# Altium schematic sheet slave-connector.SchDoc
size A3; DocumentNumber: 5; SheetNumber: 5; SheetTotal: 6; SheetDescription: Slave Connector
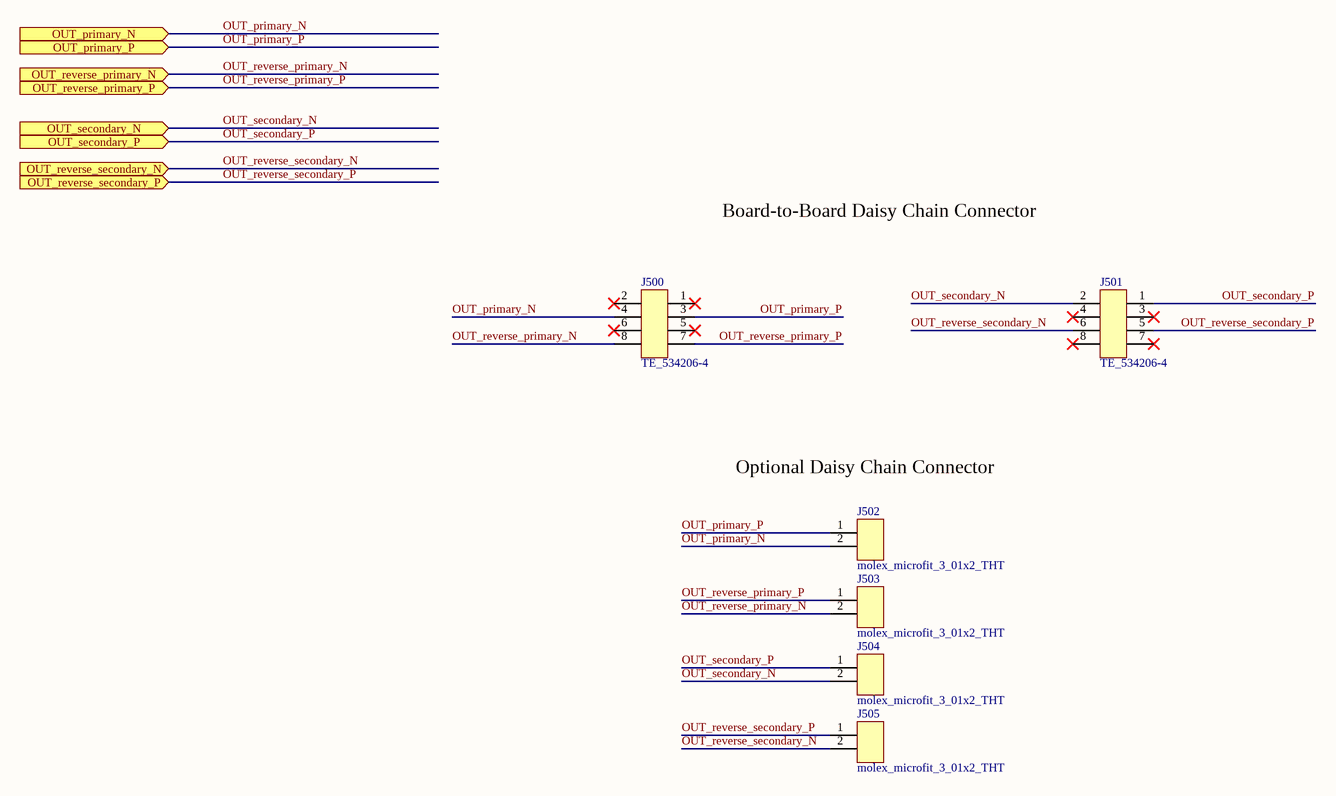
[diagram p0: slave-connector.SchDoc]

## Parts
J500  TE_534206-4  [TE_534206-4]
J501  TE_534206-4  [TE_534206-4]
J502  molex_microfit_3_01x2_THT  [MOLEX_MICROFIT_01x2_THT]
J503  molex_microfit_3_01x2_THT  [MOLEX_MICROFIT_01x2_THT]
J504  molex_microfit_3_01x2_THT  [MOLEX_MICROFIT_01x2_THT]
J505  molex_microfit_3_01x2_THT  [MOLEX_MICROFIT_01x2_THT]

## Ports
OUT_primary_N (in), OUT_primary_P (in), OUT_reverse_primary_N (in), OUT_reverse_primary_P (in), OUT_reverse_secondary_N (in), OUT_reverse_secondary_P (in), OUT_secondary_N (in), OUT_secondary_P (in)

## Nets
OUT_primary_N: J500.4 J502.2 ; port OUT_primary_N
OUT_primary_P: J500.3 J502.1 ; port OUT_primary_P
OUT_reverse_primary_N: J500.8 J503.2 ; port OUT_reverse_primary_N
OUT_reverse_primary_P: J500.7 J503.1 ; port OUT_reverse_primary_P
OUT_reverse_secondary_N: J501.6 J505.2 ; port OUT_reverse_secondary_N
OUT_reverse_secondary_P: J501.5 J505.1 ; port OUT_reverse_secondary_P
OUT_secondary_N: J501.2 J504.2 ; port OUT_secondary_N
OUT_secondary_P: J501.1 J504.1 ; port OUT_secondary_P

Not connected (* = marked no-connect by the designer): J500 1* 2* 5* 6*; J501 3* 4* 7* 8*

## Notes on the sheet
- Board-to-Board Daisy Chain Connector
- Optional Daisy Chain Connector
- Fraunhofer IISB
- Schottkystr. 10
- developed by:
- 91058 Erlangen
- Germany
- Author
- Project
- License
- Description
- File
- Version
- Release Date
- Sheet
- www.foxbms.org
- www.iisb.fraunhofer.de
- foxBMS Team
- /

## Library data of the parts
J500 J501 = TE_534206-4: Board-To-Board Connector, Dual, 2.54 mm, 8 Contacts, Receptacle, Through Hole, 2 Rows; Manufacturer: TE; Circuits: 8; Rated Voltage: 333V AC; Rated Current: 2A; Automotive Qualified: False; Part Number: TE_534206-4; Part Name: 534206-4; Operating Temperature: −65 °C - +105 °C; ComponentLink1Description: Datasheet; ComponentLink1URL: https://www.te.com/deu-de/product-534206-4.html#pdp-docs-features; Supplier 1: Digikey; Supplier Part Number 1: A26454-ND
J502-J505 = molex_microfit_3_01x2_THT: Micro-Fit 3.0 Right Angle Header, 3.00mm Pitch, Dual Row, 2 Circuits, with Snap-in Plastic Peg PCB Lock, Tin, Glow Wire Capable, Black, 43045-0200; Manufacturer: Molex; Circuits: 2; Rated Voltage: 600V; Rated Current: 8.5A; Automotive Qualified: False; Part Number: molex_microfit_3_01x2_THT; Part Name: MicroFit; Operating Temperature: -40°C - +105°C; Supplier 1: Farnell; Supplier Part Number 1: 1012251